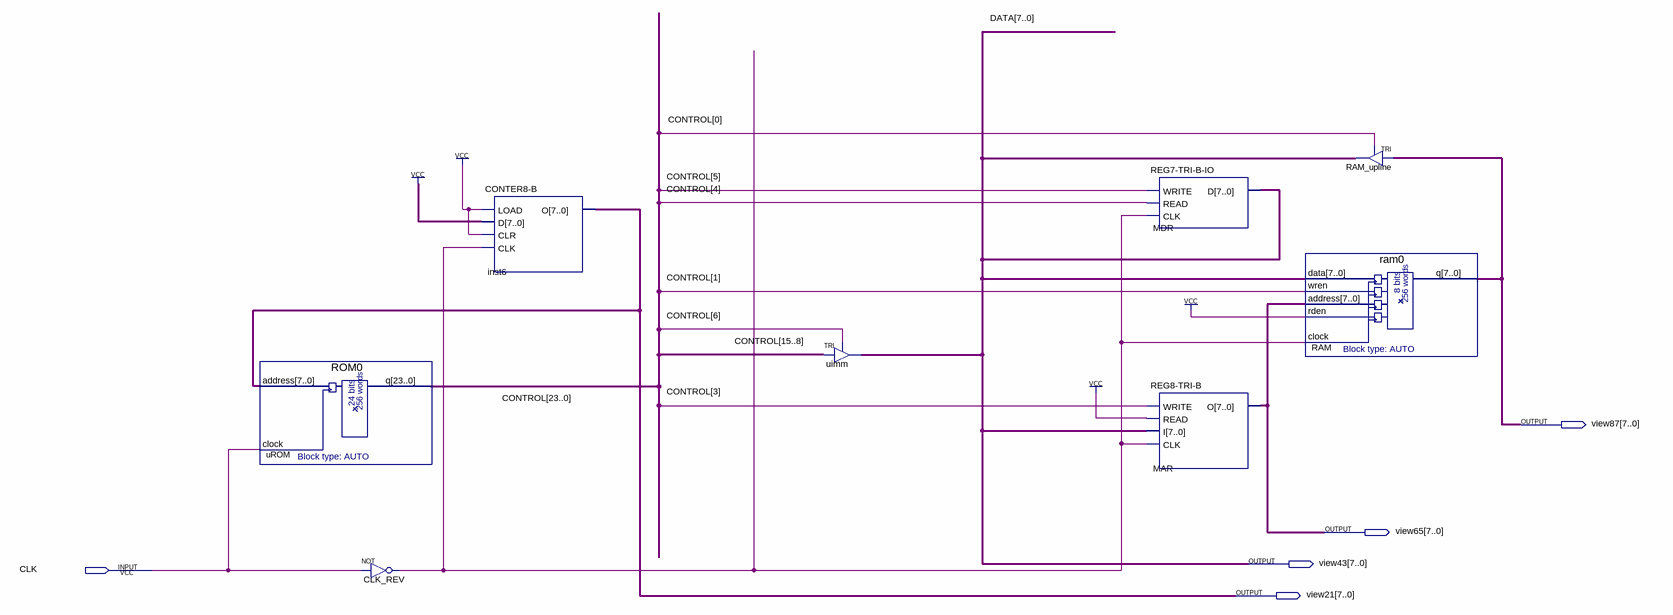
[diagram p0: schematic sheet]
// Quartus schematic EXP2.bdf as structural Verilog: 8 symbols, 5 pins
module EXP2 (
  input  CLK,
  output [7:0] view87,
  output [7:0] view65,
  output [7:0] view43,
  output [7:0] view21
);

  wire CLK_REV_out;
  wire [23:0] CONTROL;

  ROM0 uROM (.address(view21), .clock(CLK), .q(CONTROL));
  not CLK_REV (CLK_REV_out, CLK);
  \CONTER8-B  inst6 (.LOAD(1'b1), .D({8{1'b1}}), .CLR(1'b1), .CLK(CLK_REV_out), .O(view21));
  TRI uimm[7:0] (.IN(CONTROL[15:8]), .OE(CONTROL[6]), .OUT(view43));
  \REG7-TRI-B-IO  MDR (.WRITE(CONTROL[5]), .READ(CONTROL[4]), .CLK(CLK_REV_out), .D(view43));
  \REG8-TRI-B  MAR (.WRITE(CONTROL[3]), .READ(1'b1), .I(view43), .CLK(CLK_REV_out), .O(view65));
  ram0 RAM (.data(view43), .wren(CONTROL[1]), .address(view65), .rden(1'b1), .clock(CLK_REV_out), .q(view87));
  TRI RAM_upline[7:0] (.IN(view87), .OE(CONTROL[0]), .OUT(view43));

  // Other names for the same wires on the sheet: DATA[7:0] = view43
endmodule
